# EAGLE design PianoPCB (EAGLE 9.6.2)
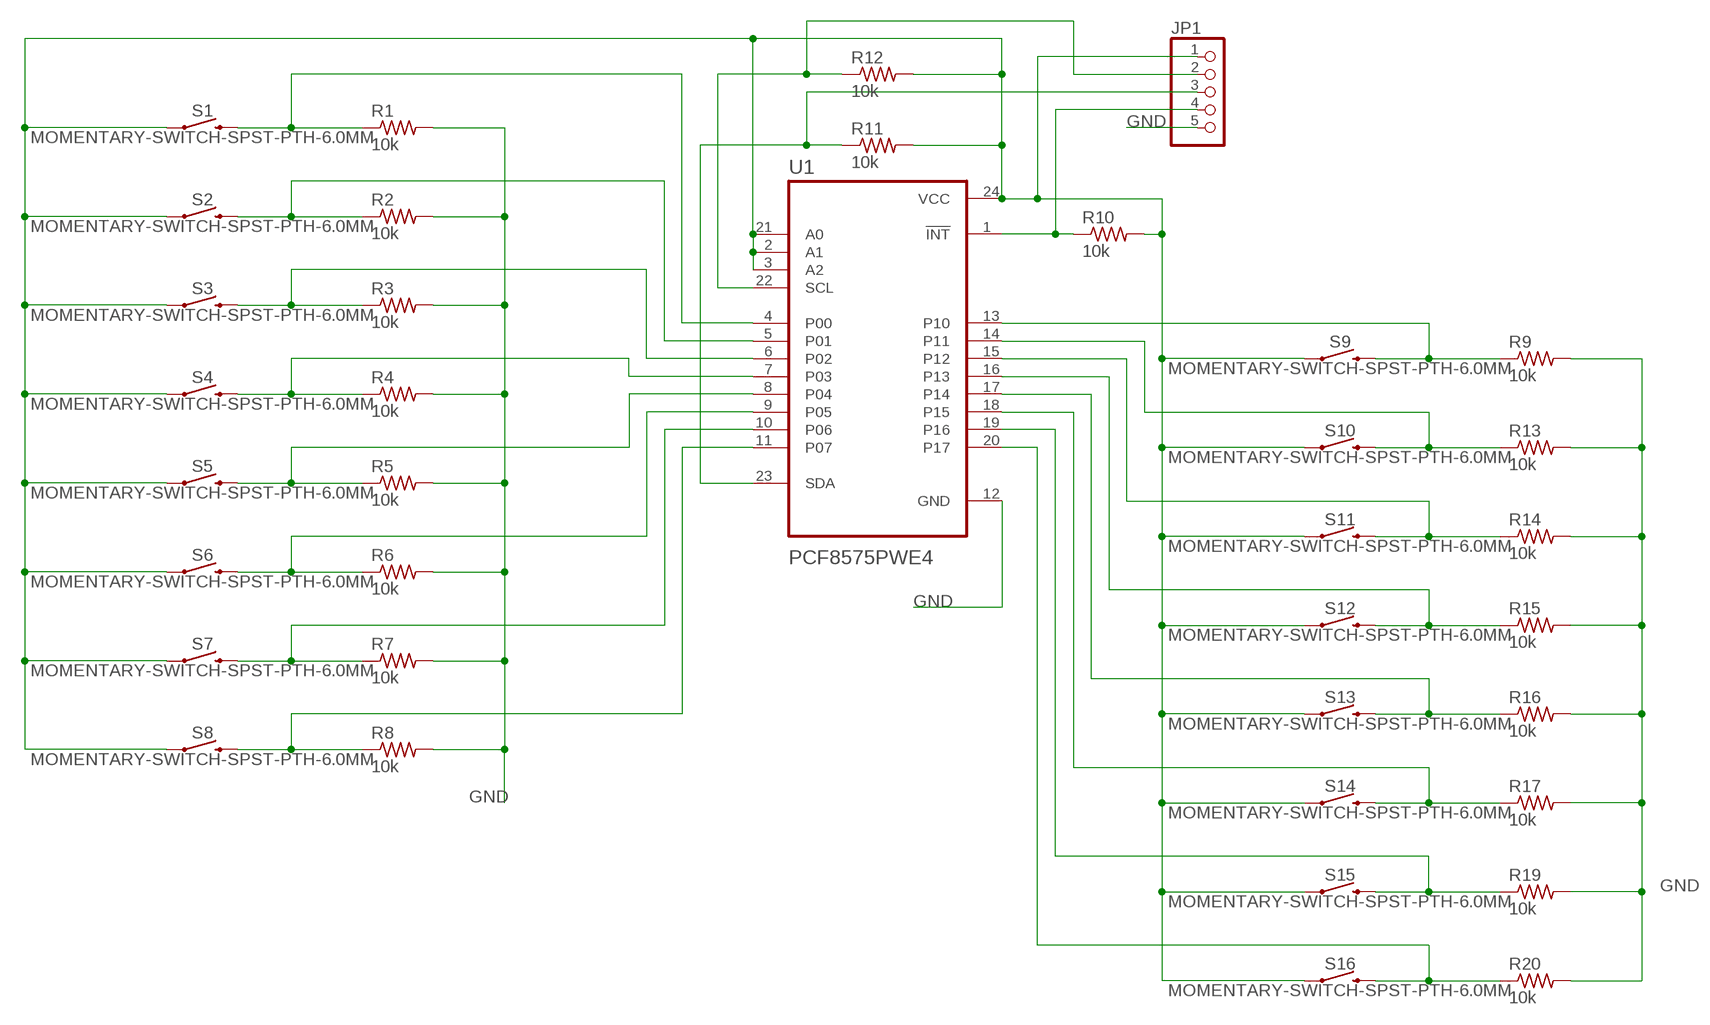
[diagram p0: schematic, sheet 1]

## Parts
JP1  PINHD-1X5  [1X05]
R1  10k  R-US_0207/10  [0207/10]
R2  10k  R-US_0207/10  [0207/10]
R3  10k  R-US_0207/10  [0207/10]
R4  10k  R-US_0207/10  [0207/10]
R5  10k  R-US_0207/10  [0207/10]
R6  10k  R-US_0207/10  [0207/10]
R7  10k  R-US_0207/10  [0207/10]
R8  10k  R-US_0207/10  [0207/10]
R9  10k  R-US_0207/10  [0207/10]
R10  10k  R-US_0207/10  [0207/10]
R11  10k  R-US_0207/10  [0207/10]
R12  10k  R-US_0207/10  [0207/10]
R13  10k  R-US_0207/10  [0207/10]
R14  10k  R-US_0207/10  [0207/10]
R15  10k  R-US_0207/10  [0207/10]
R16  10k  R-US_0207/10  [0207/10]
R17  10k  R-US_0207/10  [0207/10]
R19  10k  R-US_0207/10  [0207/10]
R20  10k  R-US_0207/10  [0207/10]
S1  MOMENTARY-SWITCH-SPST-PTH-6.0MM  [TACTILE_SWITCH_PTH_6.0MM]
S2  MOMENTARY-SWITCH-SPST-PTH-6.0MM  [TACTILE_SWITCH_PTH_6.0MM]
S3  MOMENTARY-SWITCH-SPST-PTH-6.0MM  [TACTILE_SWITCH_PTH_6.0MM]
S4  MOMENTARY-SWITCH-SPST-PTH-6.0MM  [TACTILE_SWITCH_PTH_6.0MM]
S5  MOMENTARY-SWITCH-SPST-PTH-6.0MM  [TACTILE_SWITCH_PTH_6.0MM]
S6  MOMENTARY-SWITCH-SPST-PTH-6.0MM  [TACTILE_SWITCH_PTH_6.0MM]
S7  MOMENTARY-SWITCH-SPST-PTH-6.0MM  [TACTILE_SWITCH_PTH_6.0MM]
S8  MOMENTARY-SWITCH-SPST-PTH-6.0MM  [TACTILE_SWITCH_PTH_6.0MM]
S9  MOMENTARY-SWITCH-SPST-PTH-6.0MM  [TACTILE_SWITCH_PTH_6.0MM]
S10  MOMENTARY-SWITCH-SPST-PTH-6.0MM  [TACTILE_SWITCH_PTH_6.0MM]
S11  MOMENTARY-SWITCH-SPST-PTH-6.0MM  [TACTILE_SWITCH_PTH_6.0MM]
S12  MOMENTARY-SWITCH-SPST-PTH-6.0MM  [TACTILE_SWITCH_PTH_6.0MM]
S13  MOMENTARY-SWITCH-SPST-PTH-6.0MM  [TACTILE_SWITCH_PTH_6.0MM]
S14  MOMENTARY-SWITCH-SPST-PTH-6.0MM  [TACTILE_SWITCH_PTH_6.0MM]
S15  MOMENTARY-SWITCH-SPST-PTH-6.0MM  [TACTILE_SWITCH_PTH_6.0MM]
S16  MOMENTARY-SWITCH-SPST-PTH-6.0MM  [TACTILE_SWITCH_PTH_6.0MM]
U1  PCF8575PWE4  [SOP65P640X120-24N]

## Nets
GND: JP1.5 R1.2 R2.2 R3.2 R4.2 R5.2 R6.2 R7.2 R8.2 R9.2 R13.2 R14.2 R15.2 R16.2 R17.2 R19.2 R20.2 U1.12(GND)
N$1: JP1.4 R10.1 U1.1(!INT)
N$2: R1.1 S1.3 U1.4(P00)
N$3: R2.1 S2.3 U1.5(P01)
N$4: R3.1 S3.3 U1.6(P02)
N$5: R4.1 S4.3 U1.7(P03)
N$6: R5.1 S5.3 U1.8(P04)
N$7: R6.1 S6.3 U1.9(P05)
N$8: R7.1 S7.3 U1.10(P06)
N$9: R8.1 S8.3 U1.11(P07)
N$11: R16.1 S13.3 U1.17(P14)
N$12: JP1.3 R11.1 U1.23(SDA)
N$13: JP1.2 R12.1 U1.22(SCL)
N$14: R17.1 S14.3 U1.18(P15)
N$15: R20.1 S16.3 U1.20(P17)
N$16: R19.1 S15.3 U1.19(P16)
N$22: R14.1 S11.3 U1.15(P12)
N$23: R9.1 S9.3 U1.13(P10)
N$24: R13.1 S10.3 U1.14(P11)
N$25: R15.1 S12.3 U1.16(P13)
VCC1: JP1.1 R10.2 R11.2 R12.2 S1.1 S2.1 S3.1 S4.1 S5.1 S6.1 S7.1 S8.1 S9.1 S10.1 S11.1 S12.1 S13.1 S14.1 S15.1 S16.1 U1.2(A1) U1.3(A2) U1.21(A0) U1.24(VCC)

## Library data of the parts
JP1 = pinhead:PINHD-1X5: PIN HEADER
R1-R17 R19 R20 = resistor:R-US_: RESISTOR, American symbol
S1-S16 = SparkFun-Switches:MOMENTARY-SWITCH-SPST: Momentary Switch (Pushbutton) - SPST Normally-open (NO) SPST momentary switches (buttons, pushbuttons). Variants PTH-12MM - 12mm square, through-hole Momentary Pushbutton Switch - 12mm Square <https://www.sparkfun.com/products/9190> (COM-09190) PTH-6.0MM, PTH-6.0MM-KIT - 6.0mm square, through-hole Mini Pushbutton Switch <https://www.sparkfun.com/products/97> (COM-00097) KIT package intended for soldering kit's - only one side of pads' copper is exposed. PTH-RIGHT-ANGLE-KIT - Right-angle, through-hole Right Angle Tactile Button <https://www.sparkfun.com/products/10791> - Used on SparkFun BigTime Watch Kit <https://www.sparkfun.com/products/11734> SMD-12MM - 12mm square, surface-mount Tactile Button - SMD (12mm) <https://www.sparkfun.com/products/12993> (COM-12993) Used on SparkFun PicoBoard <https://www.sparkfun.com/products/11888> SMD-4.5MM - 4.5mm Square Trackball Switch Used on SparkFun Blackberry Trackballer Breakout <https://www.sparkfun.com/products/13169> SMD-4.6MMX2.8MM - 4.60mm x 2.80mm, surface mount Used on SparkFun Pro Micro - RP2040 <https://www.sparkfun.com/products/17717> SMD-5.2MM, SMD-5.2-REDUNDANT - 5.2mm square, surface-mount Mini Pushbutton Switch - SMD <https://www.sparkfun.com/products/8720> (COM-08720) Used on Arduino Pro Mini <https://www.sparkfun.com/products/11114> REDUNDANT package connects both switch circuits together SMD-6.0X3.5MM - 6.0 x 3.5mm, surface mount Momentary Reset Switch SMD <https://www.sparkfun.com/products/8229> (COM-08229) SMD-6.2MM-TALL - 6.2mm square, surface mount Tactile Button - SMD (6mm) <https://www.sparkfun.com/products/12992> Used on SparkFun Digital Sandbox <https://www.sparkfun.com/products/12651> SMD-RIGHT-ANGLE - Right-angle, surface mount Used on SparkFun Block for Intel® Edison - Arduino <https://www.sparkfun.com/products/13036>; PROD_ID: SWCH-08441; SF_SKU: COM-00097
U1 = PCF8575PWE4:PCF8575PWE4: Check availability <https://pricing.snapeda.com/parts/PCF8575PWE4/Texas%20Instruments/view-part?ref=eda>; AVAILABILITY: In Stock; CHECK_PRICES: https://www.snapeda.com/parts/PCF8575PWE4/Texas+Instruments/view-part/?ref=eda; DESCRIPTION: Remote 16-Bit I2C and SMBus I/O Expander with Interrupt Output 24-TSSOP -40 to 85; MF: Texas Instruments; MP: PCF8575PWE4; PACKAGE: TSSOP-24 Texas Instruments; PRICE: None; PURCHASE-URL: https://www.snapeda.com/api/url_track_click_mouser/?unipart_id=561245&manufacturer=Texas Instruments&part_name=PCF8575PWE4&search_term=None; SNAPEDA_LINK: https://www.snapeda.com/parts/PCF8575PWE4/Texas+Instruments/view-part/?ref=snap

## Board
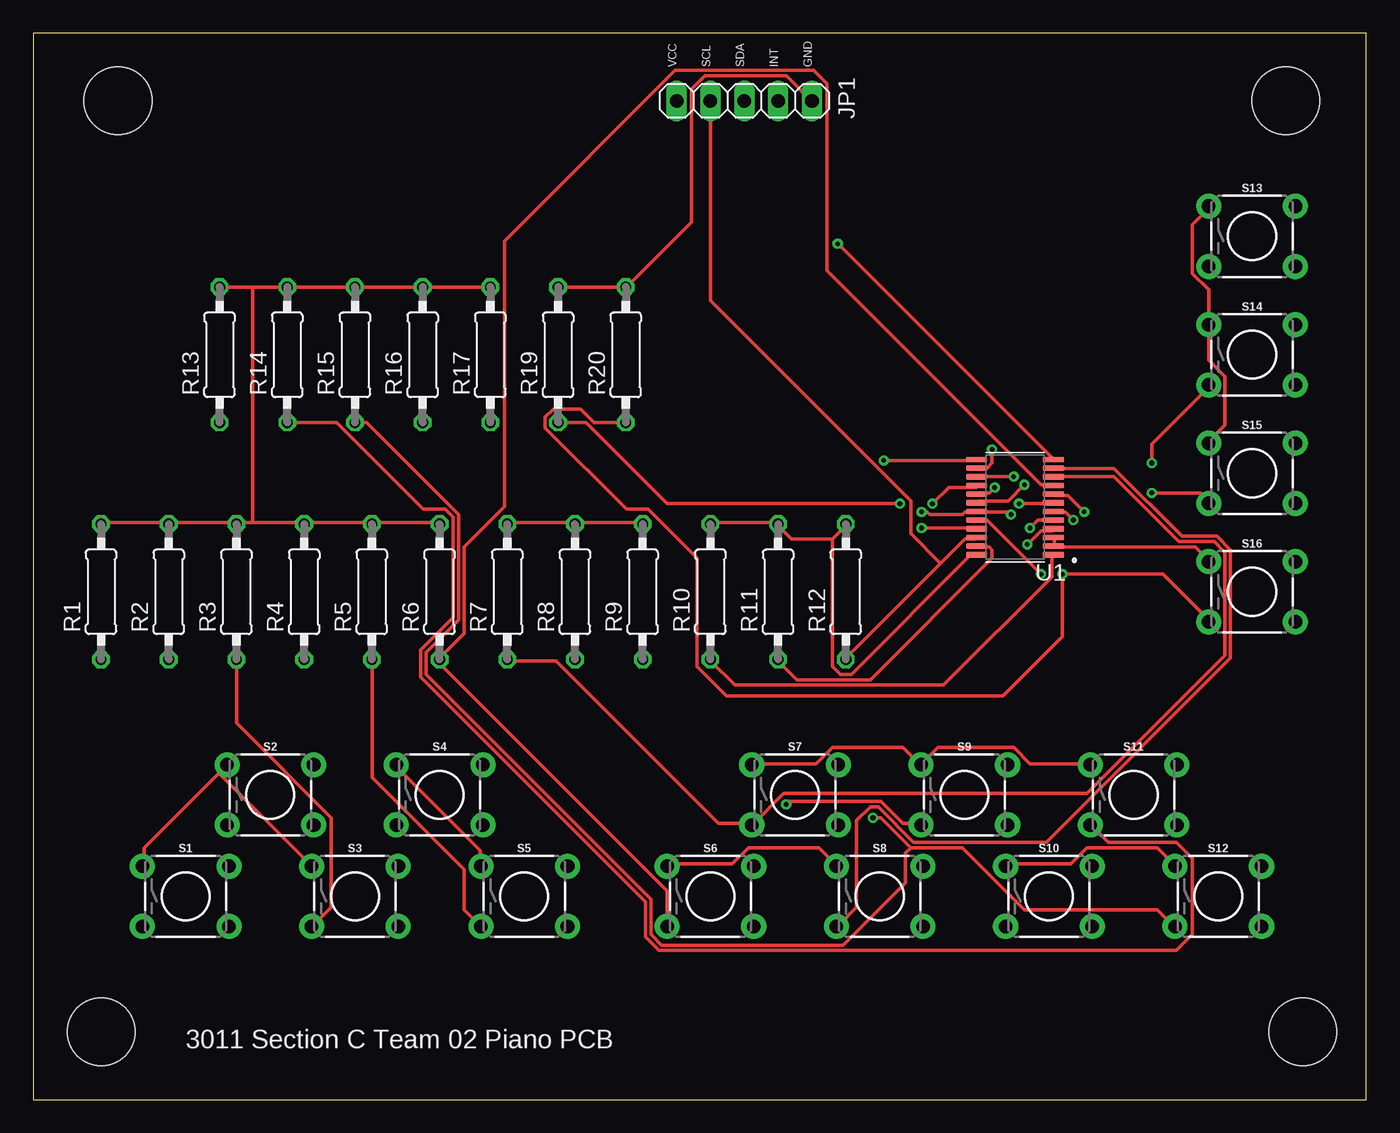
[diagram p1: board, top side]
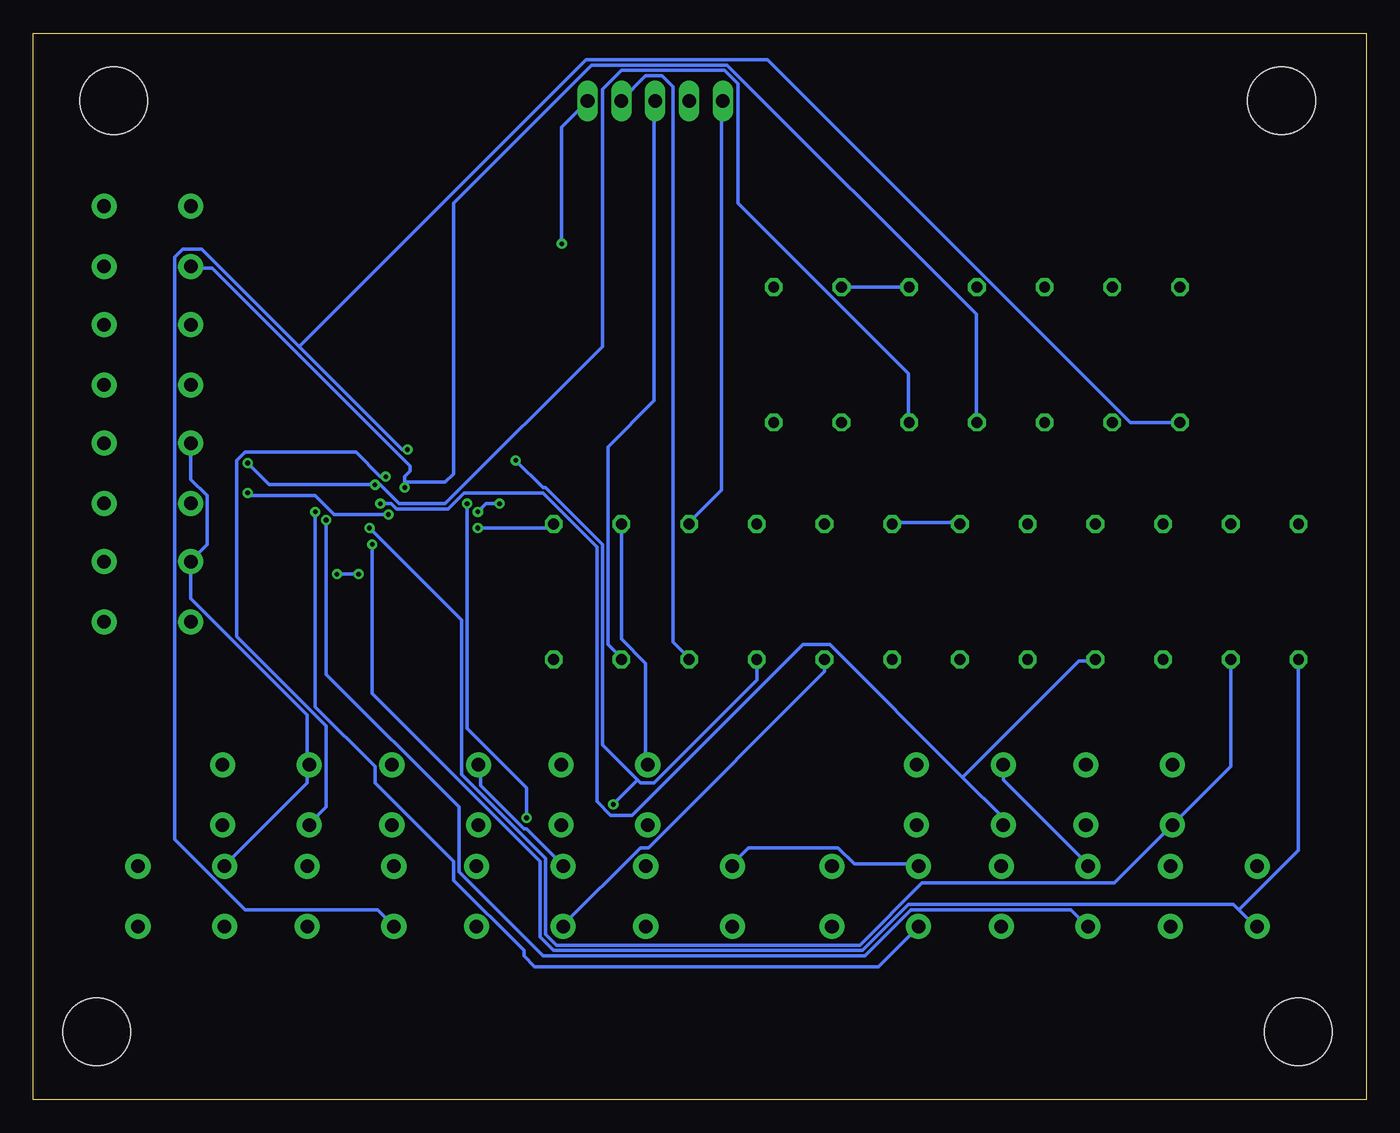
[diagram p2: board, bottom side, seen from below]

Size 100 x 80 mm. Coordinates in mm from the lower left corner, seen from the top.
Outline: 0,0 100,0 100,80 0,80 0,0
Copper layers (1*16): Top 0.035mm / dielectric 1.5mm / Bottom 0.035mm
Design rules "default *": minimum track width 10mil, minimum drill 0.35mm, track to track 6mil, track to pad 6mil, pad to pad 6mil, via to via 6mil, smd to smd 6mil, copper to edge 40mil, drill to drill 6mil, minimum pad ring 10mil, minimum via ring 8mil, stop-mask expansion 4mil, vias tented up to drill 0mil, thermal gap 10mil
Holes 5.08 mm at 6.35,74.93 93.98,74.93 5.08,5.08 95.25,5.08

### Footprints (pad centres in the part's own frame; a part is rotated, then mirrored left to right if it is on the bottom)
1X05 = drill 1.016 long: 1 -5.08,0; 2 -2.54,0; 3 0,0; 4 2.54,0; 5 5.08,0
0207/10 = drill 0.813 octagon: 1 -5.08,0; 2 5.08,0
TACTILE_SWITCH_PTH_6.0MM = drill 1.016 pad 1.88: 1 -3.251,2.261; 2 3.251,2.261; 3 -3.251,-2.261; 4 3.251,-2.261
SOP65P640X120-24N = smd 1.57 x 0.41: 1 -2.87,3.575; 2 -2.87,2.925; 3 -2.87,2.275; 4 -2.87,1.625; 5 -2.87,0.975; 6 -2.87,0.325; 7 -2.87,-0.325; 8 -2.87,-0.975; 9 -2.87,-1.625; 10 -2.87,-2.275; 11 -2.87,-2.925; 12 -2.87,-3.575; 13 2.87,-3.575; 14 2.87,-2.925; 15 2.87,-2.275; 16 2.87,-1.625; 17 2.87,-0.975; 18 2.87,-0.325; 19 2.87,0.325; 20 2.87,0.975; 21 2.87,1.625; 22 2.87,2.275; 23 2.87,2.925; 24 2.87,3.575

### Placement (x,y rotation side)
JP1  53.34,74.93 0 top
R1  5.08,38.1 90 top
R2  10.16,38.1 90 top
R3  15.24,38.1 90 top
R4  20.32,38.1 90 top
R5  25.4,38.1 90 top
R6  30.48,38.1 90 top
R7  35.56,38.1 90 top
R8  40.64,38.1 90 top
R9  45.72,38.1 90 top
R10  50.8,38.1 90 top
R11  55.88,38.1 90 top
R12  60.96,38.1 90 top
R13  13.97,55.88 90 top
R14  19.05,55.88 90 top
R15  24.13,55.88 90 top
R16  29.21,55.88 90 top
R17  34.29,55.88 90 top
R19  39.37,55.88 90 top
R20  44.45,55.88 90 top
S1  11.43,15.24 0 top
S2  17.78,22.86 0 top
S3  24.13,15.24 0 top
S4  30.48,22.86 0 top
S5  36.83,15.24 0 top
S6  50.8,15.24 0 top
S7  57.15,22.86 0 top
S8  63.5,15.24 0 top
S9  69.85,22.86 0 top
S10  76.2,15.24 0 top
S11  82.55,22.86 0 top
S12  88.9,15.24 0 top
S13  91.44,64.77 0 top
S14  91.44,55.88 0 top
S15  91.44,46.99 0 top
S16  91.44,38.1 0 top
U1  73.66,44.45 180 top

### Tracks (layer width: path | path; a pad name or v marks a point on that pad's centre or on a via)
GND  (via drill 0.35)
  Top 0.254: v60.35,64.21 76.4,48.16 U1.12 | R19.2 R20.2 44.5,60.96 49.38,65.84 49.38,75.79 50.39,76.81 56.49,76.81 58.32,74.98 JP1.5 | 16.46,60.96 R14.2 R15.2 R16.2 R17.2 | 16.46,60.96 R13.2 | 40.64,43.28 35.56,43.28 R7.2 | 40.64,43.28 45.72,43.28 R9.2 | 40.64,43.28 R8.2 | 10.16,43.28 5.08,43.28 R1.2 | 10.16,43.28 15.24,43.28 | 10.16,43.28 R2.2 | 15.24,43.28 16.46,43.28 | 16.46,43.28 20.32,43.28 | 15.24,43.28 R3.2 | 20.32,43.28 25.4,43.28 | 20.32,43.28 R4.2 | 25.4,43.28 30.48,43.28 R6.2 | 25.4,43.28 R5.2 | 16.46,43.28 16.46,60.96
  Bottom 0.254: v60.35,64.21 60.35,72.95 58.52,74.78 JP1.5 | R19.2 R17.2 | R7.2 35.56,43.28 30.48,43.28 R6.2
N$1
  Top 0.254: U1.1 76.4,40.84 76.4,39.22 68.28,31.09 52.63,31.09 50.8,32.92 R10.1
  Bottom 0.254: JP1.4 55.88,74.98 54.05,76.81 52.83,76.81 52.02,76 52.02,34.34 50.8,33.12 R10.1
N$2  (via drill 0.35)
  Top 0.254: v74.57,41.66 75.59,42.67 76.4,42.67 U1.4
  Bottom 0.254: v74.57,41.66 74.57,30.48 61.98,17.88 61.98,12.19 60.96,11.18 37.8,11.18 34.34,14.63 9.96,14.63 9.55,14.22 | 9.55,14.22 8.33,13.01 S1.3 | R1.1 5.08,18.69 9.55,14.22
N$3  (via drill 0.35)
  Top 0.254: v74.78,42.88 75.39,43.48 76.4,43.48 U1.5
  Bottom 0.254: v74.78,42.88 67.87,35.97 67.87,24.38 61.57,18.09 61.57,12.39 60.76,11.58 38,11.58 33.33,16.26 18.9,16.26 14.63,20.52 S2.3 14.43,20.73 10.16,24.99 R2.1
N$4  (via drill 0.35)
  Top 0.254: v78.03,43.48 77.42,44.09 76.61,44.09 U1.6 | R3.1 15.24,28.25 22.35,21.13 22.35,14.43 20.93,13.01 S3.3
  Bottom 0.254: v78.03,43.48 78.03,31.9 68.07,21.95 68.07,17.07 61.77,10.77 37.59,10.77 34.14,14.22 22.15,14.22 20.93,13.01 S3.3
N$5  (via drill 0.35)
  Top 0.254: v73.97,44.7 76.4,44.7 U1.7
  Bottom 0.254: v73.97,44.7 73.15,44.7 72.75,44.3 68.89,44.3 67.67,45.52 61.77,45.52 57.71,41.45 57.71,22.35 56.69,21.34 55.07,21.34 42.27,34.14 40.23,34.14 30.28,24.18 | 30.28,24.18 27.23,21.13 S4.3 | 30.28,24.18 21.54,32.92 20.32,32.92 R4.1
N$6  (via drill 0.35)
  Top 0.254: v78.84,44.09 77.62,45.31 76.61,45.31 U1.8 | R5.1 25.4,24.18 32.31,17.27 32.31,14.22 33.53,13.01 S5.3
  Bottom 0.254: v78.84,44.09 78.84,29.46 74.37,24.99 74.37,23.77 68.48,17.88 68.48,16.46 63.2,11.18 63.2,10.77 62.38,9.96 36.58,9.96 33.73,12.8 S5.3
N$7
  Top 0.254: U1.9 76.4,46.13 75.59,46.13 59.54,62.18 59.54,76.2 58.52,77.22 48.16,77.22 35.36,64.41 35.36,44.5 32.31,41.45 32.31,34.95 30.48,33.12 R6.1 30.48,32.72 47.55,15.65 S6.3
N$8
  Top 0.254: U1.10 76.61,46.74 81.08,46.74 85.95,41.86 88.59,41.86 89.41,41.05 89.41,33.33 79.05,22.96 56.29,22.96 54.05,20.73 S7.3 53.85,20.73 51.41,20.73 39.22,32.92 35.56,32.92 R7.1
N$9
  Top 0.254: U1.11 76.61,47.35 81.08,47.35 86.16,42.27 88.8,42.27 89.81,41.25 89.81,33.12 76,19.3 66.04,19.3 63.4,21.95 62.79,21.95 61.77,20.93 61.77,14.43 60.35,13.01 S8.3
  Bottom 0.254: R8.1 40.64,32.11 53.85,18.9 54.46,18.9 60.35,13.01 S8.3
N$11  (via drill 0.35)
  Top 0.254: v72.14,45.92 71.73,45.52 70.92,45.52 U1.17
  Bottom 0.254: 72.14,46.33 72.14,46.74 71.73,47.14 71.73,47.55 86.56,62.38 88.19,62.38 S13.3 | 72.14,46.33 v72.14,45.92 | 72.14,46.33 69.09,46.33 68.48,46.94 68.48,67.26 58.12,77.62 47.95,77.62 29.26,58.93 29.26,50.8 R16.1
N$12
  Top 0.254: U1.23 70.92,41.45 71.73,41.45 71.93,41.25 71.93,40.64 62.79,31.5 57.3,31.5 55.88,32.92 R11.1
  Bottom 0.254: JP1.3 53.44,74.78 53.44,52.43 56.9,48.97 56.9,34.14 55.88,33.12 R11.1
N$13
  Top 0.254: 68.07,40.23 60.96,33.12 R12.1 | 68.07,40.23 69.9,42.06 70.71,42.06 U1.22 | JP1.2 50.8,59.94 65.84,44.91 65.84,42.47 68.07,40.23
N$14  (via drill 0.35)
  Top 0.254: v74.37,46.13 73.15,44.91 70.92,44.91 U1.18 | v83.92,47.75 83.92,49.17 88.19,53.44 S14.3
  Bottom 0.254: v83.92,47.75 82.3,46.13 v74.37,46.13 73.97,46.13 72.54,44.7 69.09,44.7 57.3,56.49 57.3,75.79 55.88,77.22 48.16,77.22 47.14,76.2 47.14,67.26 34.34,54.46 34.34,50.8 R17.1
N$15  (via drill 0.35)
  Top 0.254: v75.59,39.42 71.53,43.48 70.92,43.48 U1.20 | S16.3 88.19,35.97 84.73,39.42 v77.22,39.42 77.22,34.75 72.75,30.28 52.02,30.28 49.78,32.51 49.78,40.64 46.13,44.3 44.5,44.3 38.41,50.39 38.41,51.21 39.01,51.82 41.05,51.82 42.06,50.8 R20.1
  Bottom 0.254: v77.22,39.42 v75.59,39.42
N$16  (via drill 0.35)
  Top 0.254: v73.36,43.89 73.15,44.09 70.92,44.09 U1.19 70.71,44.09 69.9,44.09 69.7,43.89 67.26,43.89 67.06,44.09 v66.65,44.09 | v83.92,45.52 87.58,45.52 88.19,44.91 S15.3 | R19.1 41.45,50.8 47.55,44.7 v65.02,44.7
  Bottom 0.254: v73.36,43.89 77.42,43.89 78.84,45.31 83.72,45.31 v83.92,45.52 | v65.02,44.7 66.04,44.7 v66.65,44.09
N$22  (via drill 0.35)
  Top 0.254: v73.56,46.74 70.92,46.74 U1.15 | R14.1 22.76,50.8 29.26,44.3 30.89,44.3 31.5,43.69 31.5,36.17 29.06,33.73 29.06,31.7 45.92,14.83 45.92,12.19 46.94,11.18 85.75,11.18 86.97,12.39 86.97,18.09 85.75,19.3 80.67,19.3 79.45,20.52 S11.3
  Bottom 0.254: v73.56,46.74 73.97,46.74 75.79,48.56 84.12,48.56 84.73,47.95 84.73,34.75 78.03,28.04 78.03,21.95 79.25,20.73 S11.3
N$23  (via drill 0.35)
  Top 0.254: v63.8,47.95 70.71,47.95 U1.13 | v56.49,22.15 56.69,22.35 63.6,22.35 65.23,20.73 66.45,20.73 S9.3
  Bottom 0.254: v63.8,47.95 61.77,45.92 61.57,45.92 57.3,41.66 57.3,26.62 54.66,23.98 | 54.66,23.98 54.46,23.77 53.44,23.77 45.72,31.5 R9.1 | 54.66,23.98 v56.49,22.15
N$24  (via drill 0.35)
  Top 0.254: v71.93,48.77 71.93,47.75 71.53,47.35 70.92,47.35 U1.14
  Bottom 0.254: v71.93,48.77 72.34,48.77 80.06,56.49 | 80.06,56.49 87.38,63.8 88.8,63.8 89.41,63.2 89.41,19.51 84.12,14.22 74.17,14.22 72.95,13.01 S10.3 | R13.1 17.68,50.8 44.91,78.03 58.52,78.03 80.06,56.49
N$25  (via drill 0.35)
  Top 0.254: v67.46,44.7 68.68,45.92 70.71,45.92 U1.16 | v62.99,21.13 63.6,21.13 65.84,18.9 | 65.84,18.9 69.7,18.9 74.37,14.22 84.33,14.22 85.55,13.01 S12.3 | R15.1 24.99,50.8 31.9,43.89 31.9,35.97 29.46,33.53 29.46,31.9 46.33,15.04 46.33,12.39 47.14,11.58 60.76,11.58 65.43,16.26 65.43,18.49 65.84,18.9
  Bottom 0.254: v67.46,44.7 67.46,27.84 62.99,23.37 v62.99,21.13
VCC1  (via drill 0.35)
  Top 0.254: 59.94,42.06 59.94,32.51 60.55,31.9 61.37,31.9 70.31,40.84 70.71,40.84 U1.24 | 59.94,42.06 60.96,43.08 R12.2 | v66.65,42.88 70.71,42.88 U1.21 | R10.2 50.8,43.28 55.88,43.28 R11.2 55.88,43.08 56.9,42.06 59.94,42.06 | S13.1 88.19,66.85 86.97,65.63 86.97,61.98 88.19,60.76 S14.1 88.19,55.47 89.41,54.25 89.41,50.6 88.19,49.38 S15.1 | U1.3 76.61,42.06 76.61,41.66 U1.2 76.61,41.45 87.17,41.45 88.19,40.44 S16.1 | S5.1 33.53,17.68 33.53,18.69 27.23,24.99 S4.1 | 13.82,24.38 14.43,24.99 S2.1 | 13.82,24.38 8.33,18.9 8.33,17.68 S1.1 | 13.82,24.38 14.02,24.38 20.73,17.68 S3.1 | S10.1 72.95,17.68 77.83,17.68 79.05,18.9 84.33,18.9 85.55,17.68 S12.1 | S6.1 47.55,17.68 52.43,17.68 53.65,18.9 58.93,18.9 60.15,17.68 S8.1 | S7.1 54.05,25.2 58.73,25.2 59.94,26.42 65.23,26.42 66.45,25.2 S9.1 66.65,25.2 67.87,26.42 73.56,26.42 74.78,25.2 79.25,25.2 S11.1
  Bottom 0.254: v66.65,42.88 61.16,42.88 60.96,43.08 R12.2 | JP1.1 48.36,74.78 48.36,45.72 50.8,43.28 R10.2 | S15.1 88.19,46.53 86.97,45.31 86.97,41.66 88.19,40.44 S16.1 88.19,37.59 79.45,28.85 79.45,25.2 S11.1 79.45,24.99 79.45,23.77 85.55,17.68 S12.1 | S4.1 27.23,23.98 20.93,17.68 S3.1 | S8.1 60.35,17.68 62.99,20.32 63.2,20.32 66.45,23.57 66.45,24.99 S9.1 | S5.1 33.73,17.68 38.41,17.68 39.62,18.9 46.33,18.9 47.55,17.68 S6.1 | R11.2 55.88,34.54 54.05,32.72 54.05,25.2 S7.1

### Text on the board
tPlace: VCC | SCL | SDA | INT | GND | 3011 Section C Team 02 Piano PCB